# Altium schematic sheet P3_POWER.SchDoc
size A
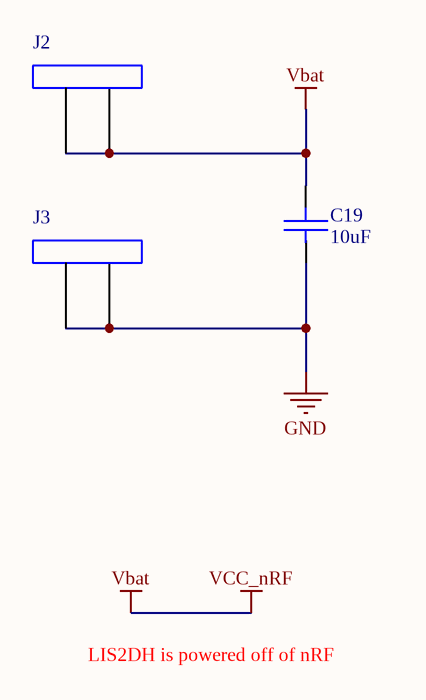
[diagram p0: P3_POWER.SchDoc]

## Parts
C19  value 10uF  [CAPC0603(1608)_N]  (hidden comment: CAP CER 10UF 6.3V 20% X5R 0603)
J2  Battery Contact Positive Low Profile  [BATT_POS_SPUTNIK]  (value not drawn)
J3  Coin Cell Battery Negative Contact  [BATT_NEG]  (value not drawn)

## Nets
GND: C19.1 J3.1 J3.2
Vbat: C19.2 J2.1 J2.2  [also labelled VCC_nRF]

## Notes on the sheet
- LIS2DH is powered off of nRF
- Title
- Size:
- Date:
- A
- Number:
- Time:
- Revision:
- Sheet
- of
- File:

## Library data of the parts
C19 = 03-01465-000: Manufacturer 1: NIC Components; Manufacturer Item 1: QM036D106MAT2A; Manufacturer Part Number 1: NMC0603X5R106M6.3TRP4KF; Case EIA: 603; Case Metric: 1608; Tolerance: +/-20%; Legacy Item Number: C04812; Temperature Coefficient: X5R; RoHS: Y; Voltage Rating: 6.3V; Manufacturer 2: Samsung Electro-Mechanics America Inc; Item Number: 03-01465-000; Item Name: CAP CER 10UF 6.3V 20% X5R 0603; Lifecycle: Design; Manufacturer Item 2: 06036D106MAT2A; Link to Arena Files: https://app.bom.com/a/0I1AGBUBUDD0EBBR?v=files.associations; Manufacturer 3: AVX Corporation; Manufacturer 4: Kemet; Manufacturer Part Number 2: CL10A106MQ8NNNC; Manufacturer Part Number 3: 06036D106MAT2A; Manufacturer Part Number 4: C0603C106M9PACTU; Revision: 1; Supplier 1: Avnet; Supplier 2: Avnet; Supplier 3: Digi-key; Supplier 4: Digi-key; Supplier Part Number 1: NMC0603X5R106M6.3TRP4KF; Supplier Part Number 2: CL10A106MQ8NNNC; Supplier Part Number 3: 478-5318-1-ND; Supplier Part Number 4: 399-5504-1-ND
J2 = 03-07197-000: Legacy Item Number: J01009; Item Number: 03-07197-000; Item Name: Battery Contact Positive Low Profile; Lifecycle: Design; Link to Arena Files: https://app.bom.com/a/0I1AGBUBUDD0109B?v=files.associations; Revision: 1
J3 = 03-07148-000: Legacy Item Number: J01003; Item Number: 03-07148-000; Item Name: Coin Cell Battery Negative Contact; RoHS: Y; Lifecycle: Other; Link to Arena Files: https://app.bom.com/a/7P8HNI1I1KK7LDUI?v=files.associations; Revision: PR1